# Altium schematic sheet wlpkt1_wejscia.SchDoc: Odkłócenie wejść
size A4; DocumentNumber: 2; SheetNumber: 2; SheetTotal: 5; Subtitle0: Odkłócenie przycisków; LotOfPieces: 1
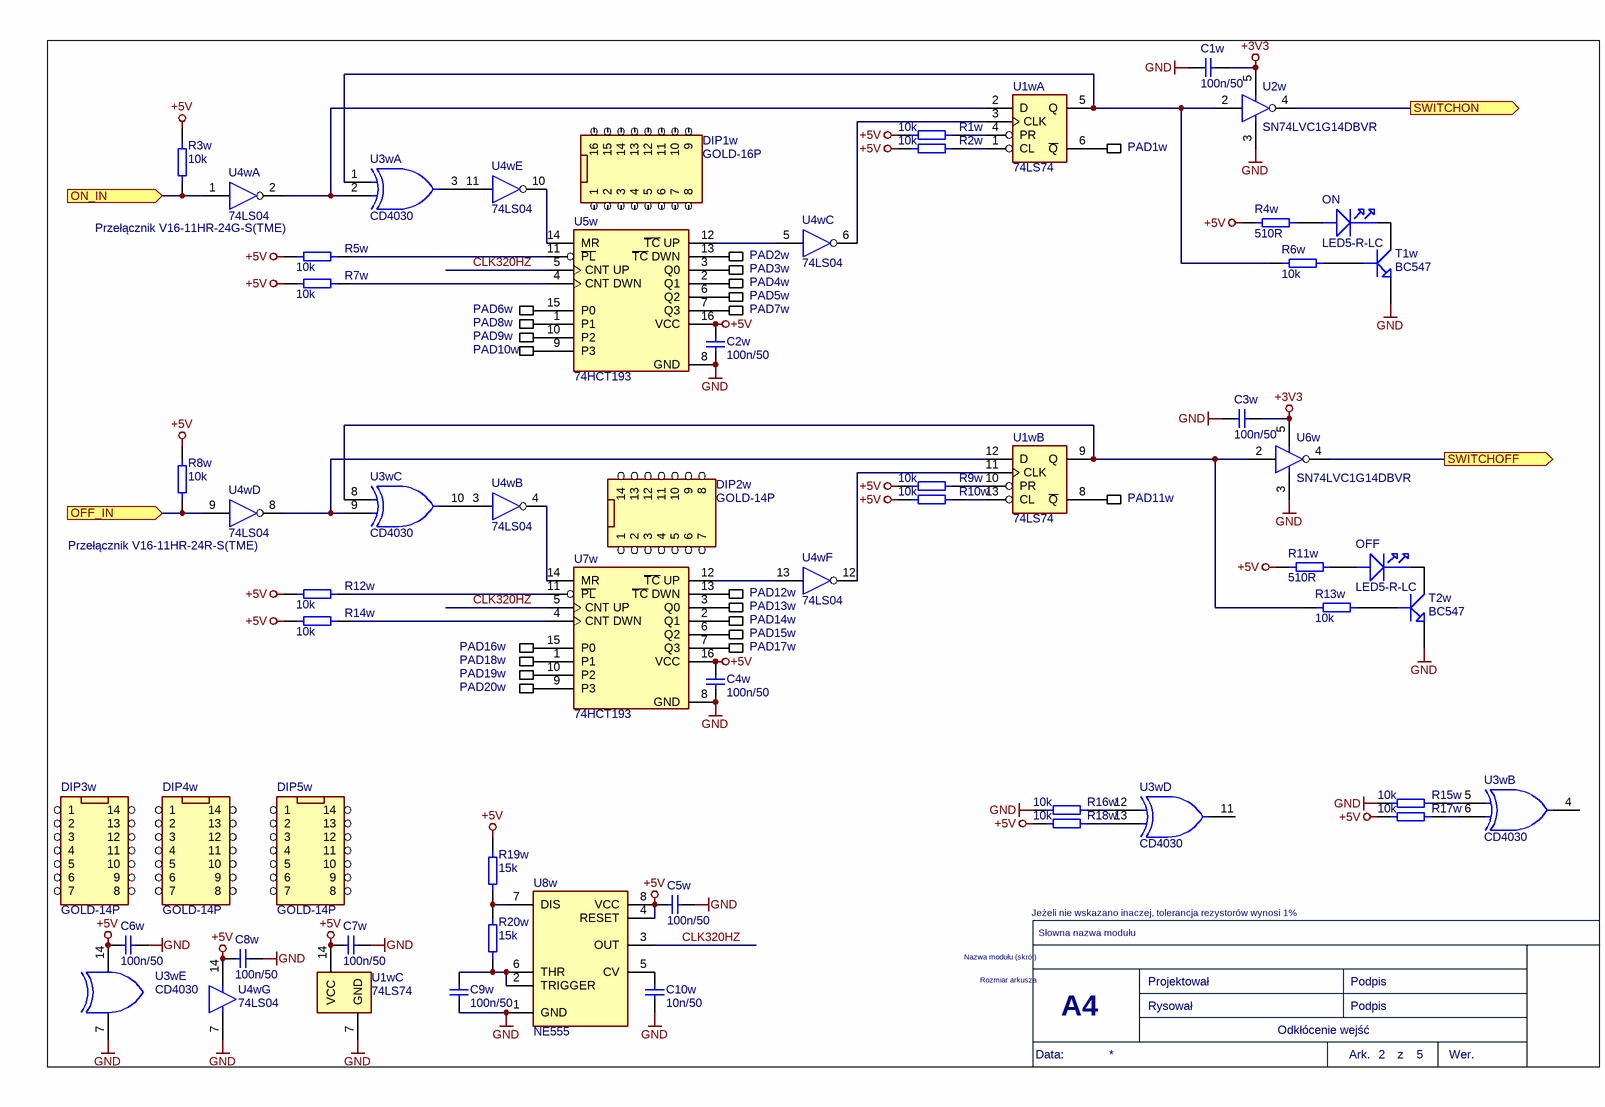
[diagram p0: wlpkt1_wejscia.SchDoc]

## Parts
C1w  100n/50  [0805]
C2w  100n/50  [0805]
C3w  100n/50  [0805]
C4w  100n/50  [0805]
C5w  100n/50  [0805]
C6w  100n/50  [0805]
C7w  100n/50  [0805]
C8w  100n/50  [0805]
C9w  100n/50  [0805]
C10w  10n/50  [0805]
DIP1w  GOLD-16P  (mechanical)
DIP2w  GOLD-14P  (mechanical)
DIP3w  GOLD-14P  (mechanical)
DIP4w  GOLD-14P  (mechanical)
DIP5w  GOLD-14P  (mechanical)
OFF  LED5-R-LC  [CO26]
ON  LED5-R-LC  [CO26]
PAD1w  PAD0_6MM  [PAD0_6MM]  (value not drawn)  (no BOM)
PAD2w  PAD0_6MM  [PAD0_6MM]  (value not drawn)  (no BOM)
PAD3w  PAD0_6MM  [PAD0_6MM]  (value not drawn)  (no BOM)
PAD4w  PAD0_6MM  [PAD0_6MM]  (value not drawn)  (no BOM)
PAD5w  PAD0_6MM  [PAD0_6MM]  (value not drawn)  (no BOM)
PAD6w  PAD0_6MM  [PAD0_6MM]  (value not drawn)  (no BOM)
PAD7w  PAD0_6MM  [PAD0_6MM]  (value not drawn)  (no BOM)
PAD8w  PAD0_6MM  [PAD0_6MM]  (value not drawn)  (no BOM)
PAD9w  PAD0_6MM  [PAD0_6MM]  (value not drawn)  (no BOM)
PAD10w  PAD0_6MM  [PAD0_6MM]  (value not drawn)  (no BOM)
PAD11w  PAD0_6MM  [PAD0_6MM]  (value not drawn)  (no BOM)
PAD12w  PAD0_6MM  [PAD0_6MM]  (value not drawn)  (no BOM)
PAD13w  PAD0_6MM  [PAD0_6MM]  (value not drawn)  (no BOM)
PAD14w  PAD0_6MM  [PAD0_6MM]  (value not drawn)  (no BOM)
PAD15w  PAD0_6MM  [PAD0_6MM]  (value not drawn)  (no BOM)
PAD16w  PAD0_6MM  [PAD0_6MM]  (value not drawn)  (no BOM)
PAD17w  PAD0_6MM  [PAD0_6MM]  (value not drawn)  (no BOM)
PAD18w  PAD0_6MM  [PAD0_6MM]  (value not drawn)  (no BOM)
PAD19w  PAD0_6MM  [PAD0_6MM]  (value not drawn)  (no BOM)
PAD20w  PAD0_6MM  [PAD0_6MM]  (value not drawn)  (no BOM)
R1w  10k  [0805R]
R2w  10k  [0805R]
R3w  10k  [0805R]
R4w  510R  [R402510]
R5w  10k  [0805R]
R6w  10k  [0805R]
R7w  10k  [0805R]
R8w  10k  [0805R]
R9w  10k  [0805R]
R10w  10k  [0805R]
R11w  510R  [R402510]
R12w  10k  [0805R]
R13w  10k  [0805R]
R14w  10k  [0805R]
R15w  10k  [0805R]
R16w  10k  [0805R]
R17w  10k  [0805R]
R18w  10k  [0805R]
R19w  15k  [0805R]
R20w  15k  [0805R]
T1w  BC547  [CE35V4]
T2w  BC547  [CE35V4]
U1w  74LS74  [14DIP300]  (parts A,B,C of 3)
U2w  SN74LVC1G14DBVR  [SOT23-5]
U3w  CD4030  [14DIP300]  (parts A,B,C,D,E of 5)
U4w  74LS04  [14DIP300]  (parts A,B,C,D,E,F,G of 7)
U5w  74HCT193  [16DIP300]
U6w  SN74LVC1G14DBVR  [SOT23-5]
U7w  74HCT193  [16DIP300]
U8w  NE555  [8DIP300]

## Ports
OFF_IN (in), ON_IN (in), SWITCHOFF (out), SWITCHON (out)

## Nets
+3V3: C1w.1 C3w.1 U2w.5(VCC) U6w.5(VCC)
+5V: C2w.1 C4w.1 C5w.1 C6w.1 C7w.1 C8w.1 R1w.1 R2w.1 R3w.1 R4w.1 R5w.1 R7w.1 R8w.1 R9w.1 R10w.1 R11w.1 R12w.1 R14w.1 R17w.1 R18w.1 R19w.1 U1w.14(VCC) U3w.14(VCC) U4w.14(VCC) U5w.16(VCC) U7w.16(VCC) U8w.4(RESET) U8w.8(VCC)
GND: C1w.2 C2w.2 C3w.2 C4w.2 C5w.2 C6w.2 C7w.2 C8w.2 C9w.2 C10w.2 R15w.1 R16w.1 T1w.EMIT T2w.EMIT U1w.7(GND) U2w.3(GND) U3w.7(GND) U4w.7(GND) U5w.8(GND) U6w.3(GND) U7w.8(GND) U8w.1(GND)
CLK320HZ: U5w.5(CNT_UP) U7w.5(CNT_UP) U8w.3(OUT)
OFF_IN: R8w.2 U4w.9(I) ; port OFF_IN
ON_IN: R3w.2 U4w.1(I) ; port ON_IN
SWITCHOFF: U6w.4(O) ; port SWITCHOFF
SWITCHON: U2w.4(O) ; port SWITCHON
NetC9w_1: C9w.1 R20w.2 U8w.2(TRIGGER) U8w.6(THR)
NetC10w_1: C10w.1 U8w.5(CV)
NetOFF_ANOD: OFF.ANOD R11w.2
NetOFF_CATH: OFF.CATH T2w.COLL
NetON_ANOD: ON.ANOD R4w.2
NetON_CATH: ON.CATH T1w.COLL
NetPAD1w_1: PAD1w.1 U1w.6(~{Q})
NetPAD2w_1: PAD2w.1 U5w.13(~{TC}_DWN)
NetPAD3w_1: PAD3w.1 U5w.3(Q0)
NetPAD4w_1: PAD4w.1 U5w.2(Q1)
NetPAD5w_1: PAD5w.1 U5w.6(Q2)
NetPAD6w_1: PAD6w.1 U5w.15(P0)
NetPAD7w_1: PAD7w.1 U5w.7(Q3)
NetPAD8w_1: PAD8w.1 U5w.1(P1)
NetPAD9w_1: PAD9w.1 U5w.10(P2)
NetPAD10w_1: PAD10w.1 U5w.9(P3)
NetPAD11w_1: PAD11w.1 U1w.8(~{Q})
NetPAD12w_1: PAD12w.1 U7w.13(~{TC}_DWN)
NetPAD13w_1: PAD13w.1 U7w.3(Q0)
NetPAD14w_1: PAD14w.1 U7w.2(Q1)
NetPAD15w_1: PAD15w.1 U7w.6(Q2)
NetPAD16w_1: PAD16w.1 U7w.15(P0)
NetPAD17w_1: PAD17w.1 U7w.7(Q3)
NetPAD18w_1: PAD18w.1 U7w.1(P1)
NetPAD19w_1: PAD19w.1 U7w.10(P2)
NetPAD20w_1: PAD20w.1 U7w.9(P3)
NetR1w_2: R1w.2 U1w.4(PR)
NetR2w_2: R2w.2 U1w.1(CL)
NetR5w_2: R5w.2 U5w.11(~{PL})
NetR6w_1: R6w.1 T1w.BASE
NetR6w_2: R6w.2 U1w.5(Q) U2w.2(I) U3w.1(I0)
NetR7w_2: R7w.2 U5w.4(CNT_DWN)
NetR9w_2: R9w.2 U1w.10(PR)
NetR10w_2: R10w.2 U1w.13(CL)
NetR12w_2: R12w.2 U7w.11(~{PL})
NetR13w_1: R13w.1 T2w.BASE
NetR13w_2: R13w.2 U1w.9(Q) U3w.8(I0) U6w.2(I)
NetR14w_2: R14w.2 U7w.4(CNT_DWN)
NetR15w_2: R15w.2 U3w.5(I0)
NetR16w_2: R16w.2 U3w.12(I0)
NetR17w_2: R17w.2 U3w.6(I1)
NetR18w_2: R18w.2 U3w.13(I1)
NetR19w_2: R19w.2 R20w.1 U8w.7(DIS)
NetU1w_2: U1w.2(D) U3w.2(I1) U4w.2(O)
NetU1w_3: U1w.3(CLK) U4w.6(O)
NetU1w_11: U1w.11(CLK) U4w.12(O)
NetU1w_12: U1w.12(D) U3w.9(I1) U4w.8(O)
NetU3w_3: U3w.3(O) U4w.11(I)
NetU3w_10: U3w.10(O) U4w.3(I)
NetU4w_4: U4w.4(O) U7w.14(MR)
NetU4w_5: U4w.5(I) U5w.12(~{TC}_UP)
NetU4w_10: U4w.10(O) U5w.14(MR)
NetU4w_13: U4w.13(I) U7w.12(~{TC}_UP)

Not connected (* = marked no-connect by the designer): DIP1w 1 2 3 4 5 6 7 8 9 10 11 12 13 14 15 16; DIP2w 1 2 3 4 5 6 7 8 9 10 11 12 13 14; DIP3w 1 2 3 4 5 6 7 8 9 10 11 12 13 14; DIP4w 1 2 3 4 5 6 7 8 9 10 11 12 13 14; DIP5w 1 2 3 4 5 6 7 8 9 10 11 12 13 14; U3w 4(O) 11(O)

## Notes on the sheet
- Przełącznik V16-11HR-24G-S(TME)
- Przełącznik V16-11HR-24R-S(TME)
- Jeżeli nie wskazano inaczej, tolerancja rezystorów wynosi 1%
- Nazwa modułu (skrót)
- Słowna nazwa modułu
- Rozmiar arkusza
- A4
- Projektował
- Rysował
- Podpis
- Data:
- Ark.
- z
- Wer.

## Library data of the parts
C1w C2w C3w C4w C5w C6w C7w C8w C9w = CAP7: Kod: CAP7; ID: 7; Descript: Kondensator: ceramiczny; MLCC; 100nF; 50V; X7R; ±10%; SMD; 0805; Reference5: CL21B104KBCNNNC; Value: 100n/50; Price5: 0; DateOfPrice5: 2010-01-01; Supplier5: tme.pl; Manufacturer5: Samsung; Typ5: CL21B104KBCNNNC
C10w = CAP21: Kod: CAP21; ID: 21; Descript: Kondensator: ceramiczny; MLCC; 10nF; 50V; X7R; ±10%; SMD; 0805; Reference5: CL21B103KBANNNC; Value: 10n/50; Price5: 0; DateOfPrice5: 2010-01-01; Supplier5: tme.pl; Manufacturer5: Samsung; Typ5: CL21B103KBANNNC
DIP1w = Con206: Kod: Con206; ID: 206; Descript: Podstawka: DIP; PIN: 16; Raster: 2,54mm; precyzyjna; THT; złocony; Typ5: DS1001-01-16BT1NSF6S; Replacement: bd; Value: GOLD-16P; Price5: 2; DateOfPrice5: 2010-01-01; Supplier5: tme; Reference5: GOLD-16P; Manufacturer5: Connfly
DIP2w DIP3w DIP4w DIP5w = Con45: Kod: Con45; ID: 45; Descript: Podstawka: DIP; PIN:14; 7,62mm; złocony; poliester; UL94V-0; 1A; Replacement: bd; Value: GOLD-14P; Price5: 2; DateOfPrice5: 2010-01-01; Supplier5: tme.pl; Reference5: GOLD-14P; Manufacturer5: Ninigi; Typ5: GOLD-14P
OFF ON = Opt27: Kod: Opt27; ID: 27; Descript: LED; 5mm; czerwony; 20mcd; 30°; Czoło: wypukłe; Raster:2,54mm; Reference5: OSNR5134A; Value: LED5-R-LC; Price5: 0; DateOfPrice5: 2010-01-01; Supplier5: tme.pl; Manufacturer5: OptoSupply; Typ5: OSNR5134A
PAD1w PAD2w PAD3w PAD4w PAD5w PAD6w PAD7w PAD8w PAD9w PAD10w PAD11w PAD12w PAD13w PAD14w PAD15w PAD16w PAD17w PAD18w PAD19w PAD20w = NOB4: Kod: NOB4; ID: 4; Descript: bd; Value: PAD0_6MM
R1w R2w R3w R5w R6w R7w R8w R9w R10w R12w R13w R14w R15w R16w R17w R18w = Res16: Kod: Res16; ID: 16; Descript: Rezystor: thick film; SMD; 0805; 10kom; 0,125W; ±1%; -55÷125°C; Reference5: SMD0805-10K-1%; Typ5: 0805S8F1002T5E; Value: 10k; Price5: 0,1; DateOfPrice5: 2020-06-25; Supplier5: tme.pl; Manufacturer5: Royal Ohm
R4w R11w = Res187: Kod: Res187; ID: 187; Descript: Rezystor: metal film; THT; 510Ω; 0,6W; ±1%; Ø2,5x6,8mm; 50ppm/°C; Reference5: M0.6W-510R; Typ5: MF006FF5100A50; Value: 510R; Price5: 0,1; DateOfPrice5: 2020-06-25; Supplier5: tme.pl; Manufacturer5: Royal Ohm
R19w R20w = Res40: Kod: Res40; ID: 40; Descript: Rezystor: thick film; SMD; 0805; 15kΩ; 0,125W; ±1%; -55÷125°C; Reference5: SMD0805-15K-1%; Typ5: 0805WAF 15K T5E; Value: 15k; Price5: 0,1; DateOfPrice5: 2020-06-25; Supplier5: tme.pl; Manufacturer5: Royal Ohm
T1w T2w = Tra9: Kod: Tra9; ID: 9; Descript: Tranzystor: NPN; bipolarny; 50V; 100mA; 500mW; TO92; Reference5: BC547A; Value: BC547; Price5: 0,1; DateOfPrice5: 2010-01-01; Supplier5: tme.pl; Manufacturer5: Diotec; Typ5: BC547A
U1w = ICs61: Kod: ICs61; ID: 61; Descript: 74LS74N IC: cyfrowy; przerzutnik D; Kanały: 2; 74LS; THT; DIP14; Value: 74LS74; Price5: 1; DateOfPrice5: 2020-12-27; Supplier5: mlach; Reference5: -; Manufacturer5: -; Typ5: -
U2w U6w = ICs245: Kod: ICs245; ID: 245; Descript: IC: cyfrowy; przerzutnik Schmitta; NOT; Kanały:1; Wejścia:1; SOT23-5; Value: SN74LVC1G14DBVR; Price5: 0; DateOfPrice5: 2010-01-01; Supplier5: tme.pl; Reference5: SN74LVC1G14DBVR; Manufacturer5: Texas Instruments; Typ5: SN74LVC1G14DBVR
U3w = ICs80: Kod: ICs80; ID: 80; Descript: CD4030BE IC: cyfrowy; XOR; CMOS; THT; DIP14; Value: CD4030; Price5: 1; DateOfPrice5: 2020-12-27; Supplier5: mlach; Reference5: -; Manufacturer5: -; Typ5: -
U4w = ICs84: Kod: ICs84; ID: 84; Descript: 74LS04N IC: cyfrowy; HEX,inwerter; Kanały: 6; THT; DIP14; Seria: 74LS; Value: 74LS04; Price5: 1; DateOfPrice5: 2020-12-27; Supplier5: mlach; Reference5: -; Manufacturer5: -; Typ5: -
U5w U7w = ICs85: Kod: ICs85; ID: 85; Descript: IC: cyfrowy; 4bit,licznik binarny w górę/w dół; Value: 74HCT193; Price5: 1; DateOfPrice5: 2020-12-27; Supplier5: mlach; Reference5: -; Manufacturer5: -; Typ5: -
U8w = ICs121: Kod: ICs121; ID: 121; Descript: Układ peryferyjny; astabilny,monostabilny,zegar RC; 10 V; DIP8; Reference5: NE555P; Value: NE555; Price5: 1,5; DateOfPrice5: 2020-11-14; Supplier5: tme.pl; Manufacturer5: TI; Typ5: NE555P